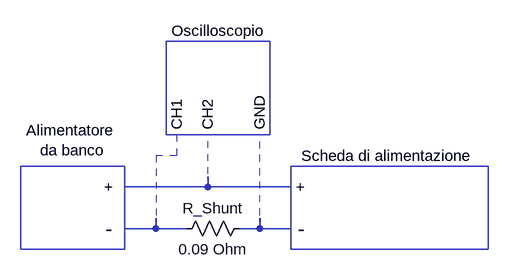
[diagram p0: schematic Draft2.asc]
Draft2.asc, the LTspice schematic file:
Version 4.1
SHEET 1 880 680
WIRE 176 112 176 96
WIRE 176 112 48 112
WIRE 304 112 176 112
WIRE 96 176 96 160
WIRE 96 176 48 176
WIRE 144 176 96 176
WIRE 256 176 256 160
WIRE 256 176 224 176
WIRE 304 176 256 176
SYMBOL res 240 160 R90
WINDOW 0 0 56 VBottom 2
WINDOW 3 32 56 VTop 2
SYMATTR InstName R_Shunt
SYMATTR Value 0.09 Ohm
TEXT 320 64 Left 2 !Scheda di alimentazione
TEXT 120 -128 Left 2 !Oscilloscopio
TEXT -32 40 Center 2 !Alimentatore \nda banco
TEXT 24 176 Center 3 !-
TEXT 16 112 Left 2 !+
TEXT 320 176 Center 3 !-
TEXT 312 112 Left 2 !+
TEXT 128 24 VLeft 2 !CH1
TEXT 176 24 VLeft 2 !CH2
TEXT 256 24 VLeft 2 !GND
LINE Normal 256 176 256 32 1
LINE Normal 176 112 176 32 1
LINE Normal 96 64 96 176 1
LINE Normal 128 64 96 64 1
LINE Normal 128 32 128 64 1
RECTANGLE Normal 272 32 112 -112
RECTANGLE Normal 608 208 304 80
RECTANGLE Normal 48 208 -112 80

The netlist it stands for:
* Draft2.asc
R_Shunt N003 N002 0.09 Ohm
Scheda di alimentazione
Oscilloscopio
Alimentatore
da banco
-
+
-
+
CH1
CH2
GND
.backanno
.end